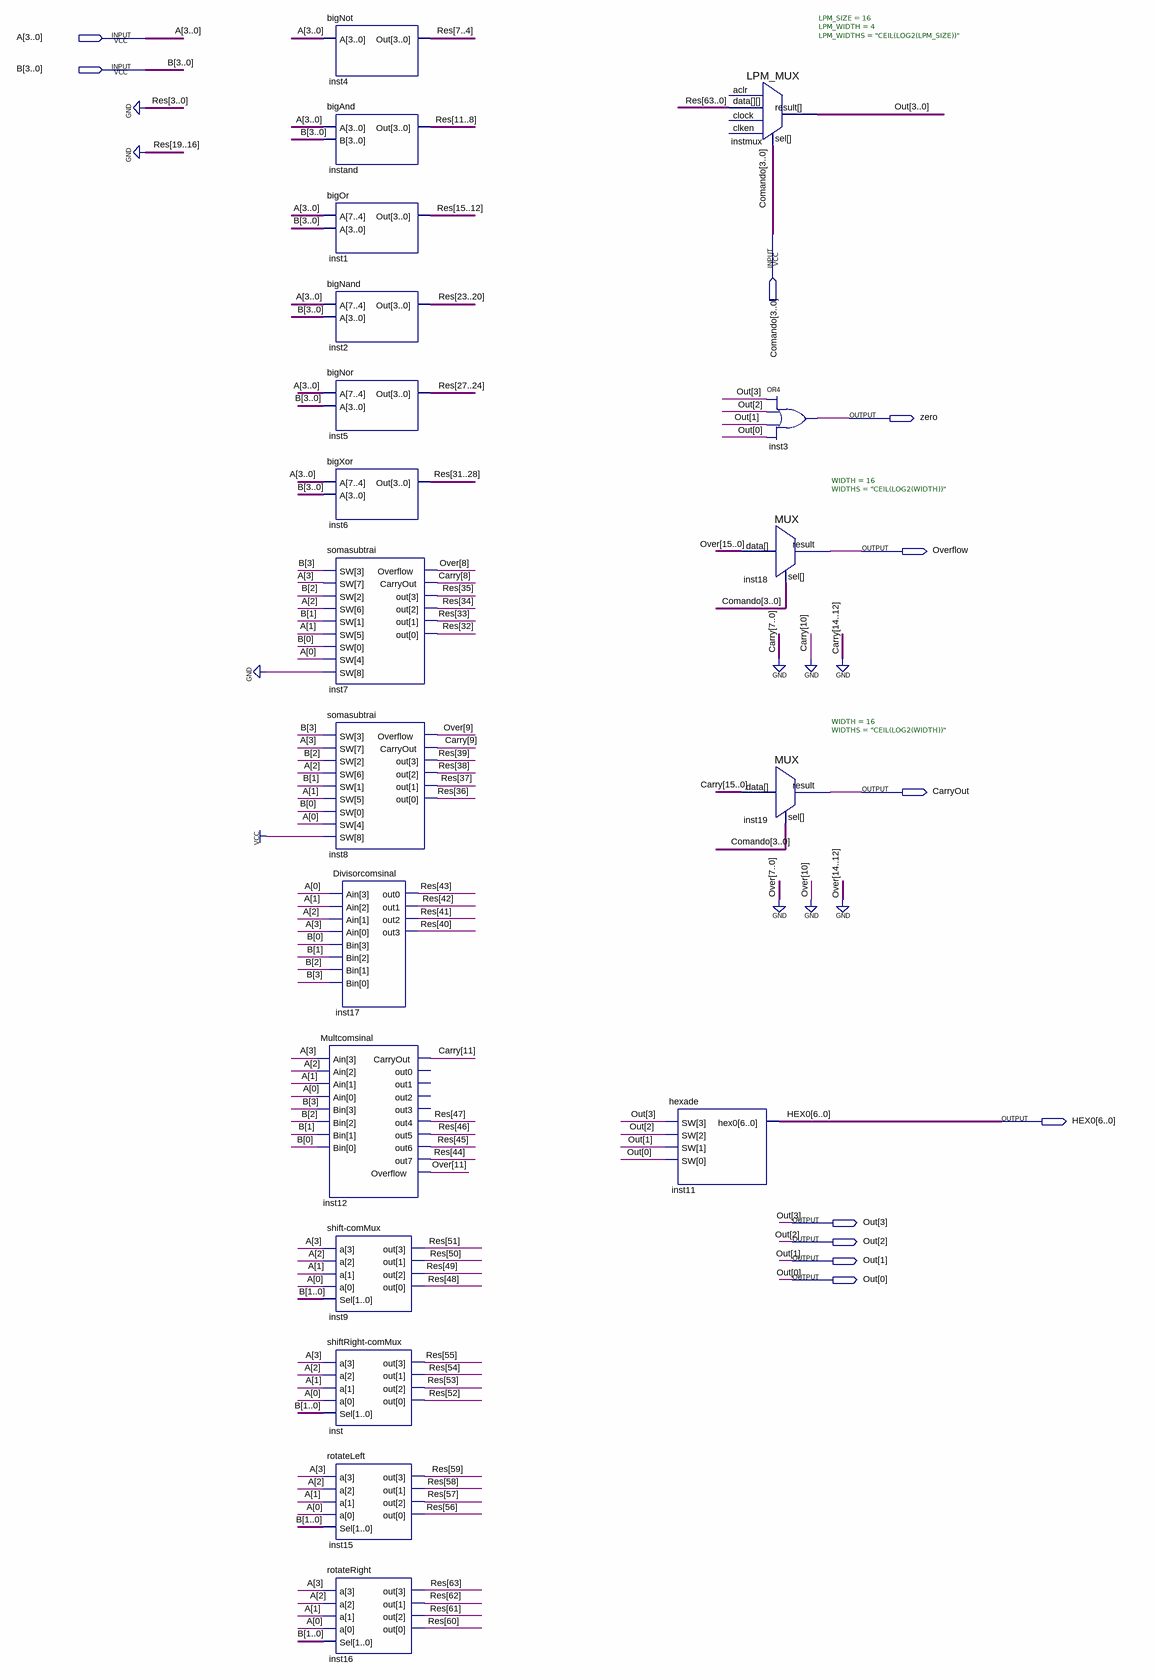
[diagram p0: schematic sheet]
// Quartus schematic Ulala.bdf as structural Verilog: 19 symbols, 11 pins
module Ulala (
  input  [3:0] A,
  input  [3:0] B,
  input  [3:0] Comando,
  output zero,
  output Overflow,
  output CarryOut,
  output [6:0] HEX0,
  output [3:0] Out
);

  wire [15:8] Carry, Over;
  wire [63:4] Res;

  bigNot inst4 (.A(A), .Out(Res[7:4]));
  bigAnd instand (.A(A), .B(B), .Out(Res[11:8]));
  bigOr inst1 (.A({A, B}), .Out(Res[15:12]));
  bigNand inst2 (.A({A, B}), .Out(Res[23:20]));
  bigNor inst5 (.A({A, B}), .Out(Res[27:24]));
  bigXor inst6 (.A({A, B}), .Out(Res[31:28]));
  somasubtrai inst7 (.SW({1'b0, A, B}), .Overflow(Over[8]), .CarryOut(Carry[8]), .out(Res[35:32]));
  somasubtrai inst8 (.SW({1'b1, A, B}), .Overflow(Over[9]), .CarryOut(Carry[9]), .out(Res[39:36]));
  Multcomsinal inst12 (
    .Ain(A), .Bin(B), .CarryOut(Carry[11]), .out4(Res[47]), .out5(Res[46]), .out6(Res[45]), .out7(Res[44]),
    .Overflow(Over[11]));  // open: out0, out1, out2, out3
  \shift-comMux  inst9 (.a(A), .Sel(B[1:0]), .out({Res[51], Res[49], Res[50], Res[48]}));
  \shiftRight-comMux  inst (.a(A), .Sel(B[1:0]), .out({Res[55], Res[53], Res[54], Res[52]}));
  rotateLeft inst15 (.a(A), .Sel(B[1:0]), .out({Res[59], Res[57], Res[58], Res[56]}));
  rotateRight inst16 (.a(A), .Sel(B[1:0]), .out({Res[63], Res[61], Res[62], Res[60]}));
  Divisorcomsinal inst17 (
    .Ain({A[0], A[1], A[2], A[3]}), .Bin({B[0], B[1], B[2], B[3]}), .out0(Res[43]), .out1(Res[42]),
    .out2(Res[41]), .out3(Res[40]));
  hexade inst11 (.SW(Out), .hex0(HEX0));
  LPM_MUX #(.LPM_SIZE(16), .LPM_WIDTH(4), .LPM_WIDTHS("CEIL(LOG2(LPM_SIZE))")) instmux (
    .data({Res[63:20], 4'b0000, Res[15:4], 4'b0000}), .sel(Comando), .result(Out));  // open: clock, aclr, clken
  or inst3 (zero, Out[3], Out[2], Out[1], Out[0]);
  MUX #(.WIDTH(16), .WIDTHS("CEIL(LOG2(WIDTH))")) inst18 (
    .data({Over[15], 3'b000, Over[11], 1'b0, Over[9:8], {8{1'b0}}}), .sel(Comando), .result(Overflow));
  MUX #(.WIDTH(16), .WIDTHS("CEIL(LOG2(WIDTH))")) inst19 (
    .data({Carry[15], 3'b000, Carry[11], 1'b0, Carry[9:8], {8{1'b0}}}), .sel(Comando), .result(CarryOut));
endmodule
